# EAGLE design IRreceiver (EAGLE 9.4.2)
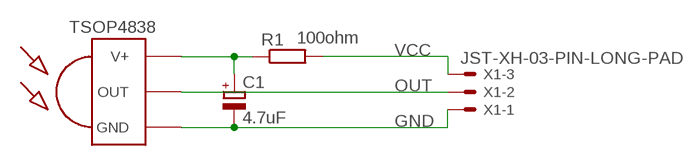
[diagram p0: schematic, sheet 1]

## Parts
C1  4.7uF  CPOL-EU153CLV-0405  [153CLV-0405]
R1  100ohm  R-EU_R0805  [R0805]
U$1  TSOP4838  [TSOP18XX]
X1  JST-XH-03-PIN-LONG-PAD  [JST-XH-03-PACKAGE-LONG-PAD]

## Nets
GND: C1.- U$1.GND X1.1
N$1: C1.+ R1.1 U$1.VCC(V+)
OUT: U$1.OUT X1.2
VCC: R1.2 X1.3

## Library data of the parts
C1 = rcl:CPOL-EU: POLARIZED CAPACITOR, European symbol; SPICEPREFIX: C
R1 = rcl:R-EU_: RESISTOR, European symbol; SPICEPREFIX: R
U$1 = tsop-1:TSOP4838: IR Receiver and Demodulator
X1 = Rembrandt Electronics - JST XH Connectors v1-0:JST-XH-03-PIN: JST XH Connector 2 Pin Wire to board connector. Pitch: 2,54 mm, (0.100") Number of pins: 3 Created by Rembrandt Electronics www.rembrandtelectronics.com

## Board
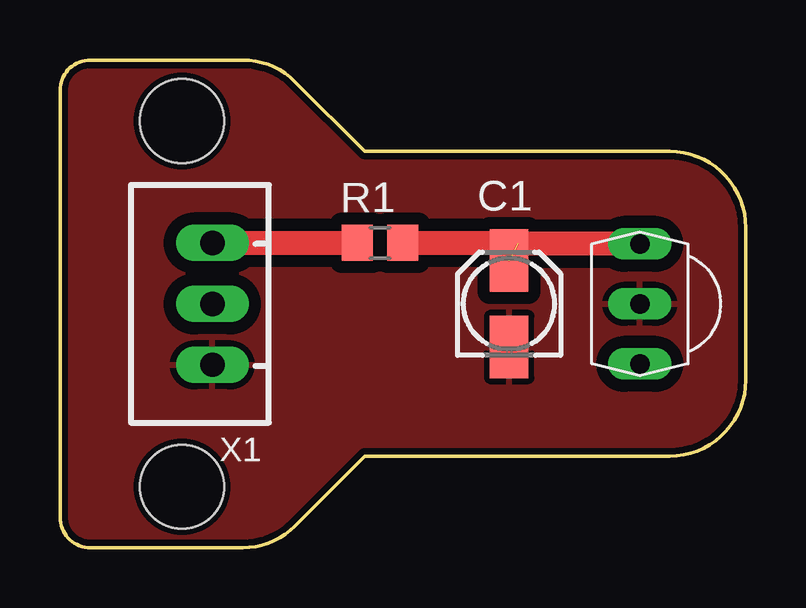
[diagram p1: board, top side]
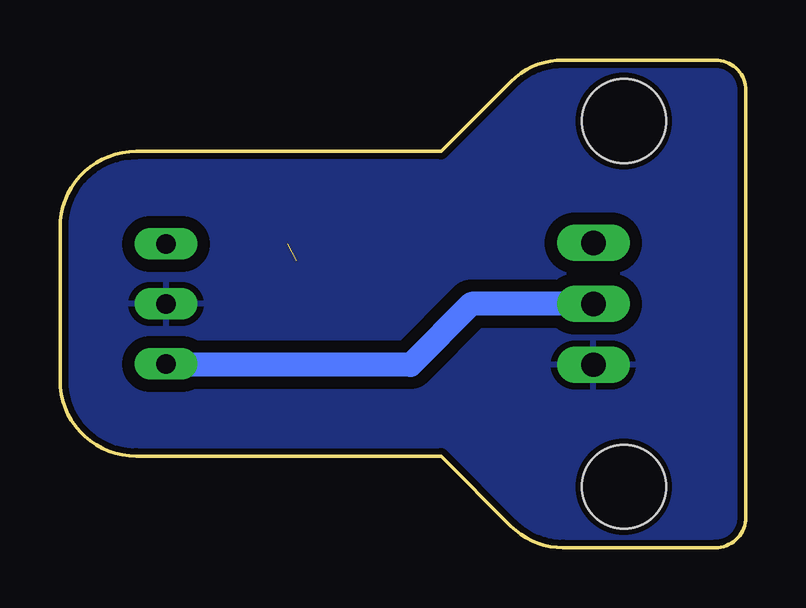
[diagram p2: board, bottom side, seen from below]

Size 28.57 x 20.32 mm. Coordinates in mm from the lower left corner, seen from the top.
Outline: 1.27,0 arc-90 0,1.27 0,19.05 arc-90 1.27,20.32 7.62,20.32 arc-45 9.79,19.42 12.7,16.51 25.4,16.51 arc-90 28.57,13.34 28.57,6.99 arc-90 25.4,3.81 12.7,3.81 9.79,0.9 arc-45 7.62,0 1.27,0
Copper layers (1*16): Top 0.035mm / dielectric 1.5mm / Bottom 0.035mm
Design rules "default *": minimum track width 6mil, minimum drill 0.35mm, track to track 20mil, track to pad 20mil, pad to pad 6mil, via to via 6mil, smd to smd 6mil, copper to edge 10mil, drill to drill 6mil, minimum pad ring 10mil, minimum via ring 8mil, stop-mask expansion 4mil, vias tented up to drill 0mil, thermal gap 10mil
Holes 3.5 mm at 5.08,17.78 5.08,2.54

### Footprints (pad centres in the part's own frame; a part is rotated, then mirrored left to right if it is on the bottom)
153CLV-0405 = smd 2.6 x 1.6: + 1.8,0; - -1.8,0
R0805 = smd 1.3 x 1.5: 1 -0.95,0; 2 0.95,0
TSOP18XX = drill 0.813 long: GND -0.001,-0.027; OUT -2.501,-0.027; VCC 2.499,-0.027
JST-XH-03-PACKAGE-LONG-PAD = drill 1.016 long: 1 -2.54,0; 2 0,0; 3 2.54,0

### Placement (x,y rotation side)
C1  18.71,10.16 90 top
R1  13.34,12.7 180 top
U$1  24.13,10.16 90 top
X1  6.35,10.16 90 top

### Tracks (layer width: path | path; a pad name or v marks a point on that pad's centre or on a via)
GND
  pour Bottom: 7.62,0 1.27,0 arc-90 0,1.27 0,19.05 arc-90 1.27,20.32 7.62,20.32 arc-45 9.79,19.42 12.7,16.51 25.3,16.51 arc-90 28.68,13.12 28.68,7.2 arc-90 25.3,3.81 12.7,3.81 9.79,0.9 arc-45
  pour Top: 7.62,0 1.27,0 arc-90 0,1.27 0,19.05 arc-90 1.27,20.32 7.62,20.32 arc-45 9.79,19.42 12.7,16.51 25.3,16.51 arc-90 28.68,13.12 28.68,7.09 arc-90 25.4,3.81 12.7,3.81 9.79,0.9 arc-45
N$1  (1 unrouted)
  Top 0.152: 17.97,12.7 C1.+ | 19.09,12.66 19.05,12.7
  Top 1: R1.1 17.97,12.7 | U$1.VCC 19.09,12.66
OUT
  Bottom 0.152: 24.12,7.62 U$1.OUT
  Bottom 1: X1.2 11.43,10.16 13.97,7.62 24.12,7.62
VCC
  Top 1: X1.3 R1.2